# EAGLE design MKVCO (EAGLE 9.2.0)
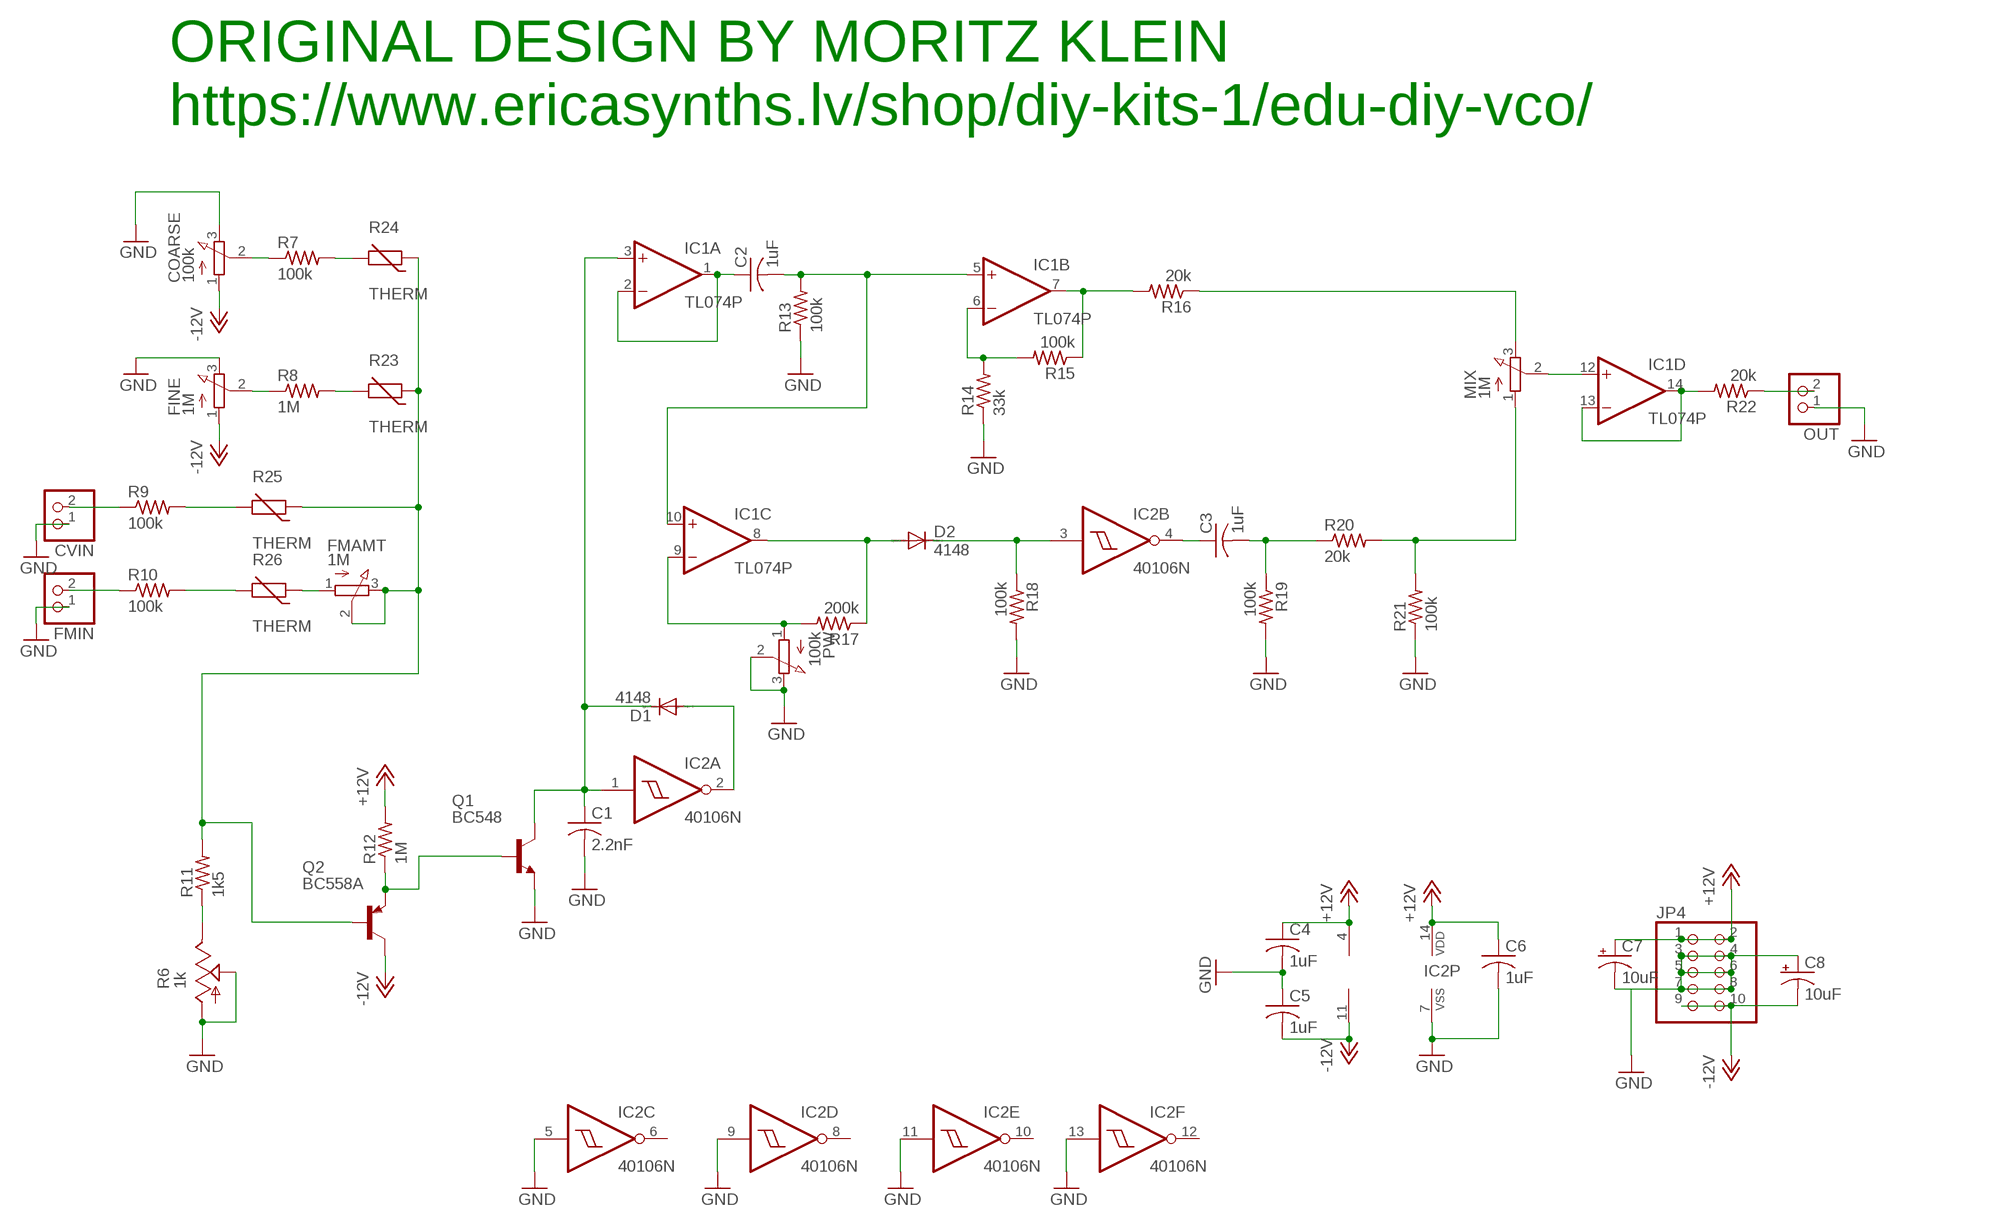
[diagram p0: schematic, sheet 1]

## Parts
C1  2.2nF  C-US050-025X075  [C050-025X075]
C2  1uF  C-US050-025X075  [C050-025X075]
C3  1uF  C-US050-025X075  [C050-025X075]
C4  1uF  C-US050-024X044  [C050-024X044]
C5  1uF  C-US050-024X044  [C050-024X044]
C6  1uF  C-US050-024X044  [C050-024X044]
C7  10uF  CPOL-USE1.8-4  [E1,8-4]
C8  10uF  CPOL-USE1.8-4  [E1,8-4]
COARSE  100k  3RP/1610N  [3RP/1610N]
CVIN  PINHD-1X2  [1X02]
D1  4148  1N4148DO35-7  [DO35-7]
D2  4148  1N4148DO35-7  [DO35-7]
FINE  1M  3RP/1610N  [3RP/1610N]
FMAMT  1M  3RP/1610N  [3RP/1610N]
FMIN  PINHD-1X2  [1X02]
IC1  TL074P  [DIL14]
IC2  40106N  [DIL14]
JP4  PINHD-2X5  [2X05]
MIX  1M  3RP/1610N  [3RP/1610N]
OUT  PINHD-1X2  [1X02]
PW  100k  3RP/1610N  [3RP/1610N]
Q1  BC548  [TO92-EBC]
Q2  BC558A  [TO92-EBC]
R6  1k  TRIM_US-B64Y  [B64Y]
R7  100k  R-US_0207/10  [0207/10]
R8  1M  R-US_0207/10  [0207/10]
R9  100k  R-US_0207/10  [0207/10]
R10  100k  R-US_0207/10  [0207/10]
R11  1k5  R-US_0207/10  [0207/10]
R12  1M  R-US_0207/10  [0207/10]
R13  100k  R-US_0207/10  [0207/10]
R14  33k  R-US_0207/10  [0207/10]
R15  100k  R-US_0207/10  [0207/10]
R16  20k  R-US_0207/10  [0207/10]
R17  200k  R-US_0207/10  [0207/10]
R18  100k  R-US_0207/10  [0207/10]
R19  100k  R-US_0207/10  [0207/10]
R20  20k  R-US_0207/10  [0207/10]
R21  100k  R-US_0207/10  [0207/10]
R22  20k  R-US_0207/10  [0207/10]
R23  THERM  THERMISTOR-2,5  [RS-2,5]
R24  THERM  THERMISTOR-2,5  [RS-2,5]
R25  THERM  THERMISTOR-2,5  [RS-2,5]
R26  THERM  THERMISTOR-2,5  [RS-2,5]

## Nets
+12V: C4.1 C6.1 C7.+ IC1.4(P:V+) IC2.14(P:VDD) JP4.1 JP4.2 R12.2
-12V: C5.2 C8.- COARSE.1(A) FINE.1(A) IC1.11(P:V-) JP4.9 JP4.10 Q2.C
GND: C1.2 C4.2 C5.1 C6.2 C7.- C8.+ COARSE.3(E) CVIN.1 FINE.3(E) FMIN.1 IC2.5(C:I) IC2.7(P:VSS) IC2.9(D:I) IC2.11(E:I) IC2.13(F:I) JP4.3 JP4.4 JP4.5 JP4.6 JP4.7 JP4.8 OUT.1 PW.2(S) PW.3(E) Q1.E R6.A R6.S R13.1 R14.1 R18.2 R19.2 R21.1
N$1: COARSE.2(S) R7.1
N$2: FINE.2(S) R8.1
N$3: CVIN.2 R9.1
N$4: R9.2 R25.2
N$5: FMAMT.2(S) FMAMT.3(E) Q2.B R11.2 R23.1 R24.1 R25.1
N$7: C1.1 D1.C IC1.3(A:+IN) IC2.1(A:I) Q1.C
N$8: D1.A IC2.2(A:O)
N$9: R6.E R11.1
N$10: IC1.12(D:+IN) MIX.2(S)
N$11: IC1.13(D:-IN) IC1.14(D:OUT) R22.2
N$12: Q1.B Q2.E R12.1
N$13: C2.1 IC1.1(A:OUT) IC1.2(A:-IN)
N$14: C2.2 IC1.5(B:+IN) IC1.10(C:+IN) R13.2
N$15: OUT.2 R22.1
N$16: IC1.9(C:-IN) PW.1(A) R17.2
N$17: D2.A IC1.8(C:OUT) R17.1
N$18: R7.2 R24.2
N$19: MIX.3(E) R16.1
N$20: D2.C IC2.3(B:I) R18.1
N$21: C3.1 IC2.4(B:O)
N$22: C3.2 R19.1 R20.1
N$23: IC1.6(B:-IN) R14.2 R15.2
N$24: IC1.7(B:OUT) R15.1 R16.2
N$25: MIX.1(A) R20.2 R21.2
N$26: R8.2 R23.2
N$27: R10.2 R26.2
N$28: FMIN.2 R10.1
N$29: FMAMT.1(A) R26.1
Unconnected: IC2.6(C:O) IC2.8(D:O) IC2.10(E:O) IC2.12(F:O)

## Notes on the sheet
- ORIGINAL DESIGN BY MORITZ KLEIN
  https://www.ericasynths.lv/shop/diy-kits-1/edu-diy-vco/

## Library data of the parts
C1-C6 = rcl:C-US: CAPACITOR, American symbol; SPICEPREFIX: C
C7 C8 = rcl:CPOL-US: POLARIZED CAPACITOR, American symbol; SPICEPREFIX: C
COARSE FINE FMAMT MIX PW = pot:3RP/1610N: 16mm Potentiometer one level Source: http://www.alphapotentiometers.net/html/16mm_pot_2.html
CVIN FMIN OUT = pinhead:PINHD-1X2: PIN HEADER
D1 D2 = diode:1N4148: DIODE high speed (Philips)
IC1 = linear:TL074: OP AMP
IC2 = 40xx:40106: Hex SCHMITT TRIGGER
JP4 = pinhead:PINHD-2X5: PIN HEADER
Q1 = transistor-npn:BC548*: NPN Transistor
Q2 = transistor-pnp:BC558*: PNP Transistror
R6 = pot:TRIM_US-: POTENTIOMETER
R7-R22 = rcl:R-US_: RESISTOR, American symbol; SPICEPREFIX: R
R23-R26 = varistor:THERMISTOR: THERMISTOR

## Board
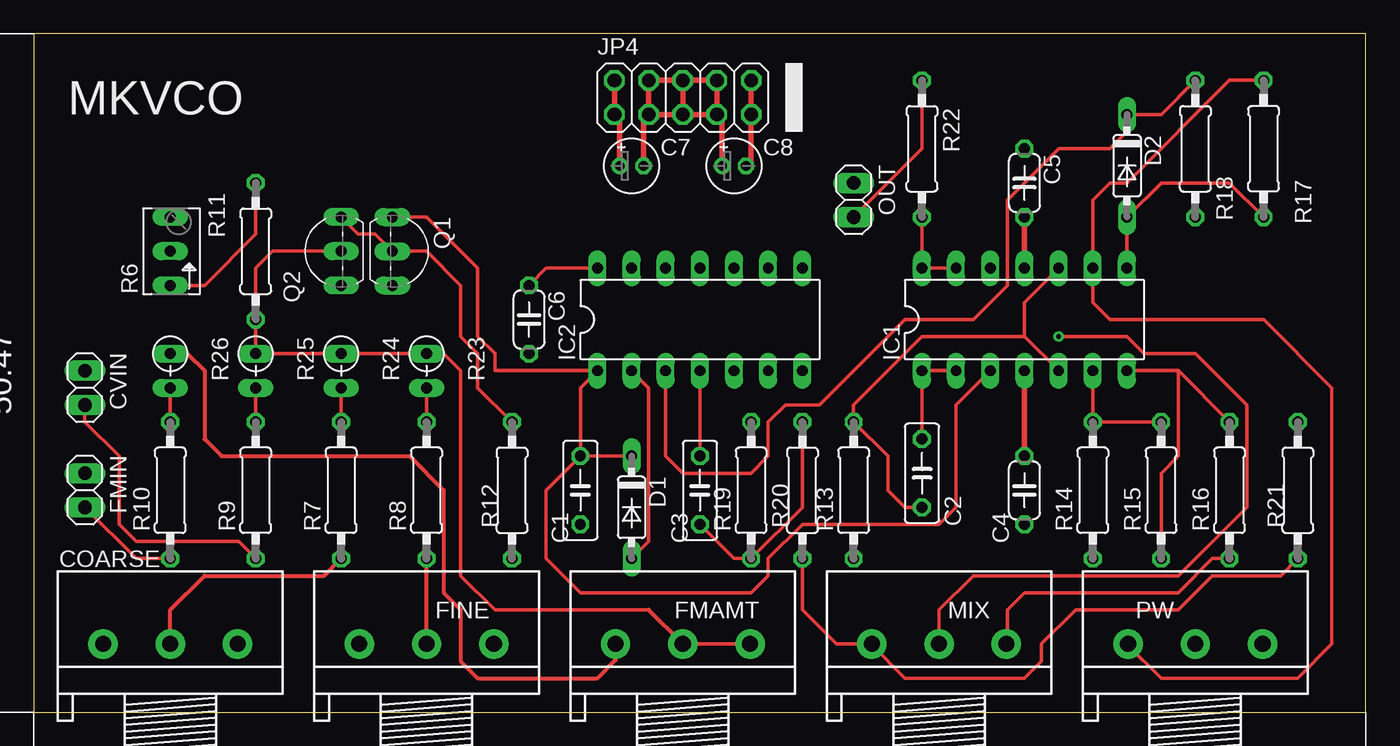
[diagram p1: board, top side]
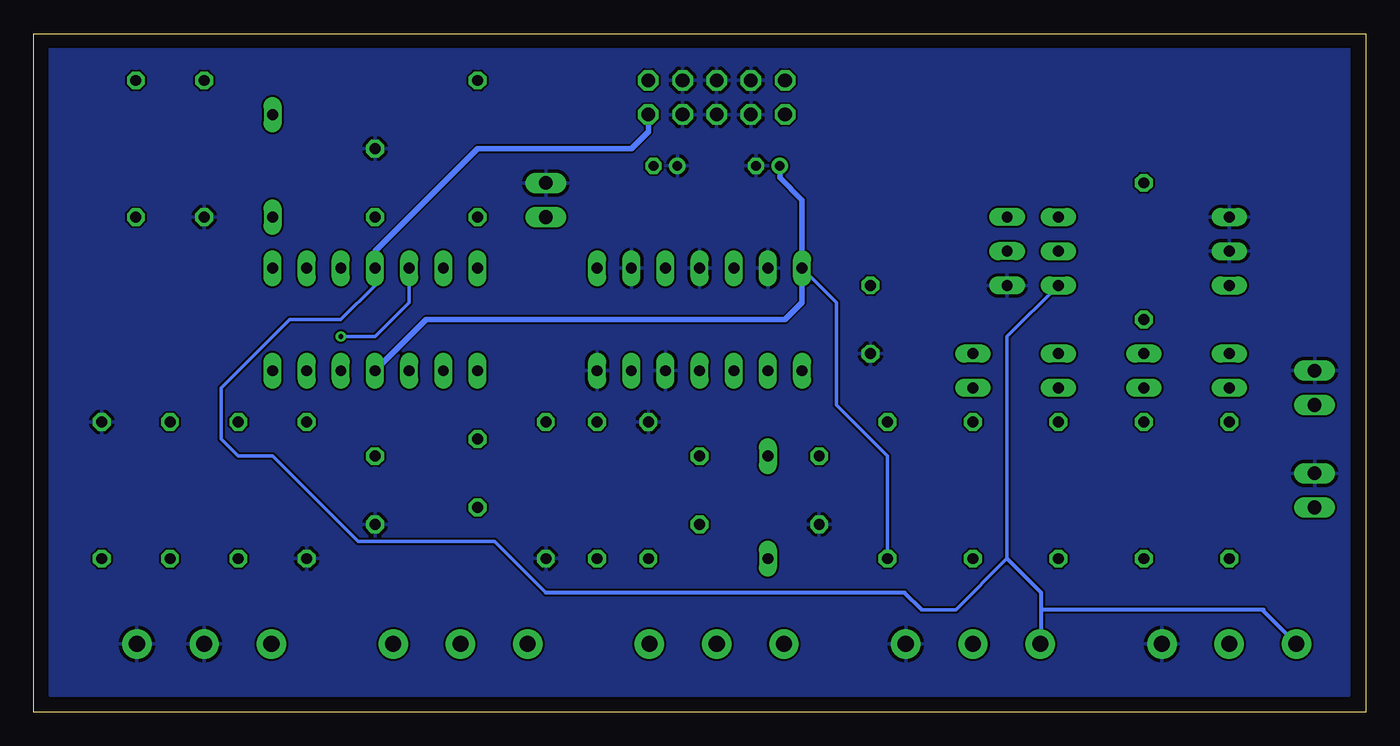
[diagram p2: board, bottom side, seen from below]

Size 99.04 x 50.47 mm. Coordinates in mm from the lower left corner, seen from the top.
Outline: 0,0 99.04,0 99.04,50.47 0,50.47 0,0
Copper layers (1*16): Top 0.035mm / dielectric 1.5mm / Bottom 0.035mm
Design rules "default": minimum track width 6mil, minimum drill 0.35mm, track to track 6mil, track to pad 6mil, pad to pad 6mil, via to via 6mil, smd to smd 6mil, copper to edge 40mil, drill to drill 6mil, minimum pad ring 10mil, minimum via ring 8mil, stop-mask expansion 4mil, vias tented up to drill 0mil, thermal gap 10mil

### Footprints (pad centres in the part's own frame; a part is rotated, then mirrored left to right if it is on the bottom)
C050-025X075 = drill 0.813 octagon: 1 -2.54,0; 2 2.54,0
C050-024X044 = drill 0.813 octagon: 1 -2.54,0; 2 2.54,0
E1,8-4 = drill 0.711 pad 1.168: + -0.889,0 | drill 0.711 pad 1.168 octagon: - 0.889,0
3RP/1610N = drill 1.2 pad 2.184: 1 -5,0; 2 0,0; 3 5,0
1X02 = drill 1.016 long: 1 -1.27,0; 2 1.27,0
DO35-7 = drill 0.813 long: A 3.81,0; C -3.81,0
DIL14 = drill 0.813 long: 1 -7.62,-3.81; 2 -5.08,-3.81; 3 -2.54,-3.81; 4 0,-3.81; 5 2.54,-3.81; 6 5.08,-3.81; 7 7.62,-3.81; 8 7.62,3.81; 9 5.08,3.81; 10 2.54,3.81; 11 0,3.81; 12 -2.54,3.81; 13 -5.08,3.81; 14 -7.62,3.81
2X05 = drill 1.016 octagon: 1 -5.08,-1.27; 2 -5.08,1.27; 3 -2.54,-1.27; 4 -2.54,1.27; 5 0,-1.27; 6 0,1.27; 7 2.54,-1.27; 8 2.54,1.27; 9 5.08,-1.27; 10 5.08,1.27
TO92-EBC = drill 0.813 long: B 0,-1.27; C -2.54,-1.27; E 2.54,-1.27
B64Y = drill 0.813 long: A 2.54,0; E -2.54,0; S 0,0
0207/10 = drill 0.813 octagon: 1 -5.08,0; 2 5.08,0
RS-2,5 = drill 0.813 long: 1 -1.27,0; 2 1.27,0

### Placement (x,y rotation side)
C1  40.64,16.51 270 top
C2  66.04,17.78 270 top
C3  49.53,16.51 270 top
C4  73.66,16.51 270 top
C5  73.66,39.37 270 top
C6  36.83,29.21 270 top
C7  44.45,40.64 0 top
C8  52.07,40.64 0 top
COARSE  10.16,5.08 0 top
CVIN  3.81,24.13 270 top
D1  44.45,15.24 270 top
D2  81.28,40.64 270 top
FINE  29.21,5.08 0 top
FMAMT  48.26,5.08 0 top
FMIN  3.81,16.51 270 top
IC1  73.66,29.21 0 top
IC2  49.53,29.21 0 top
JP4  48.26,45.72 0 top
MIX  67.31,5.08 0 top
OUT  60.96,38.1 270 top
PW  86.36,5.08 0 top
Q1  27.94,34.29 270 top
Q2  21.59,34.29 90 top
R6  10.16,34.29 90 top
R7  22.86,16.51 90 top
R8  29.21,16.51 90 top
R9  16.51,16.51 90 top
R10  10.16,16.51 90 top
R11  16.51,34.29 270 top
R12  35.56,16.51 270 top
R13  60.96,16.51 90 top
R14  78.74,16.51 90 top
R15  83.82,16.51 90 top
R16  88.9,16.51 90 top
R17  91.44,41.91 90 top
R18  86.36,41.91 270 top
R19  53.34,16.51 90 top
R20  57.15,16.51 270 top
R21  93.98,16.51 270 top
R22  66.04,41.91 270 top
R23  29.21,25.4 270 top
R24  22.86,25.4 270 top
R25  16.51,25.4 270 top
R26  10.16,25.4 270 top

### Tracks (layer width: path | path; a pad name or v marks a point on that pad's centre or on a via)
+12V
  Top 0.254: C6.1 38.1,33.02 IC2.14
  Top 0.406: JP4.2 JP4.1 43.56,44.07 C7.+ | IC1.4 C4.1
  Bottom 0.254: R12.2 35.56,19.05 39.37,22.86 39.37,30.48 IC2.14
  Bottom 0.406: C7.+ 43.56,39.75 41.91,38.1 IC2.14 41.91,30.48 43.18,29.21 69.85,29.21 IC1.4
-12V
  Top 0.406: JP4.10 JP4.9 53.34,41.02 C8.- | C5.2 IC1.11
  Bottom 0.254: 60.96,8.89 63.5,11.43 64.77,12.7 74.93,12.7 81.28,19.05 83.82,19.05 85.09,20.32 85.09,24.13 80.01,29.21 76.2,29.21 73.66,31.75 IC1.11 | Q2.C 26.67,27.94 26.67,11.43 30.48,7.62 33.02,7.62
  Bottom 0.305: FINE.1 24.13,5.16 24.13,7.62 | 24.13,7.62 24.13,8.89 26.67,11.43 | COARSE.1 7.62,7.54 7.62,7.62 24.13,7.62 | 33.02,7.62 34.29,8.89 60.96,8.89
  Bottom 0.406: IC1.11 73.66,34.29 66.04,41.91 54.61,41.91 53.34,43.18 JP4.9
GND
  Top 0.406: JP4.3 JP4.4 JP4.6 | JP4.6 JP4.8 JP4.7 | JP4.5 JP4.3 | JP4.6 JP4.5 | JP4.7 JP4.5 | C8.+ 51.18,44.07 JP4.7 | C7.- 45.34,44.07 JP4.3
  pour Bottom: 1.27,49.53 97.79,49.53 97.79,1.27 1.27,1.27
N$1
  Top 0.305: COARSE.2 10.16,7.62 12.7,10.16 21.59,10.16 R7.1
N$2
  Top 0.305: FINE.2 R8.1
N$3
  Top 0.254: CVIN.2 3.81,21.59 6.35,19.05 6.35,13.97 7.62,12.7 15.24,12.7 R9.1
N$4
  Top 0.254: R9.2 R25.2
N$5
  Top 0.254: FMAMT.2 FMAMT.3 | 45.72,7.62 34.29,7.62 31.75,10.16 31.75,25.4 30.48,26.67 R23.1 R24.1 R25.1 R11.2 16.51,33.02 17.78,34.29 Q2.B
  Top 0.305: FMAMT.2 45.72,7.62
N$7
  Top 0.254: C1.1 40.64,24.13 IC2.1 34.29,25.4 34.29,26.67 33.02,27.94 33.02,33.02 29.21,36.83 Q1.C | D1.C C1.1 | C1.1 38.1,16.51 38.1,11.43 40.64,8.89 53.34,8.89 54.61,10.16 54.61,11.43 57.15,13.97 67.31,13.97 68.58,15.24 68.58,22.86 IC1.3
N$8
  Top 0.254: D1.A 45.72,12.7 45.72,24.13 IC2.2
N$9
  Top 0.254: R6.E 12.7,31.75 16.51,35.56 R11.1
N$10  (via drill 0.35)
  Top 0.254: v76.2,27.94 81.28,27.94 82.55,26.67 86.36,26.67 90.17,22.86 90.17,15.24 85.09,10.16 69.85,10.16 67.31,7.62 MIX.2
  Bottom 0.254: IC1.12 71.12,30.48 73.66,27.94 v76.2,27.94
N$11
  Top 0.254: R22.2 IC1.14 IC1.13
N$12
  Top 0.254: Q2.E 24.13,35.56 25.4,35.56 Q1.B 29.21,34.29 31.75,31.75 31.75,27.94 33.02,26.67 33.02,24.13 R12.1
N$13
  Top 0.254: C2.1 IC1.1 IC1.2
N$14
  Top 0.254: C2.2 64.77,15.24 63.5,16.51 63.5,19.05 R13.2 60.96,22.86 66.04,27.94 73.66,27.94 | IC1.5 73.66,27.94 | IC1.10 73.66,30.48 73.66,27.94
N$15
  Top 0.254: OUT.2 66.04,41.91 R22.1
N$16
  Top 0.254: R17.2 88.9,46.99 81.28,39.37 80.01,39.37 78.74,38.1 IC1.9 78.74,30.48 80.01,29.21 91.44,29.21 96.52,24.13 96.52,5.08 93.98,2.54 83.82,2.54 81.36,5 PW.1
N$17
  Top 0.254: IC1.8 D2.A 83.82,39.37 88.9,39.37 R17.1
N$18
  Top 0.254: R7.2 R24.2
N$19
  Top 0.254: MIX.3 72.39,5.16 72.39,7.62 73.66,8.89 85.09,8.89 87.63,11.43 R16.1
N$20
  Top 0.254: R18.1 83.82,44.45 D2.C 81.28,43.18 80.01,41.91 76.2,41.91 72.39,38.1 72.39,31.75 69.85,29.21 64.77,29.21 58.42,22.86 55.88,22.86 54.61,21.59 54.61,19.05 53.34,17.78 48.26,17.78 46.99,19.05 IC2.3
N$21
  Top 0.254: C3.1 IC2.4
N$22
  Top 0.254: C3.2 52.07,11.43 R19.1 57.15,15.24 R20.1
N$23
  Top 0.254: IC1.6 R14.2 R15.2
N$24
  Top 0.254: R16.2 85.09,25.4 | 85.09,25.4 IC1.7 | R15.1 83.82,17.78 85.09,19.05 85.09,25.4
N$25
  Top 0.254: R20.2 57.15,7.62 59.69,5.08 62.23,5.08 | 62.23,5.08 MIX.1 | R21.2 92.71,10.16 87.63,10.16 85.09,7.62 77.47,7.62 74.93,5.08 74.93,3.81 73.66,2.54 64.77,2.54 62.23,5.08
N$26
  Top 0.254: R8.2 R23.2
N$27
  Top 0.254: R10.2 R26.2
N$28
  Top 0.254: FMIN.2 7.62,11.43 R10.1
N$29
  Top 0.305: R26.1 11.43,26.67 12.7,25.4 12.7,20.32 13.97,19.05 27.94,19.05 30.48,16.51 30.48,8.89 31.75,7.62 31.75,3.81 33.02,2.54 41.91,2.54 43.26,3.89 FMAMT.1

### Text on the board
tNames: MKVCO